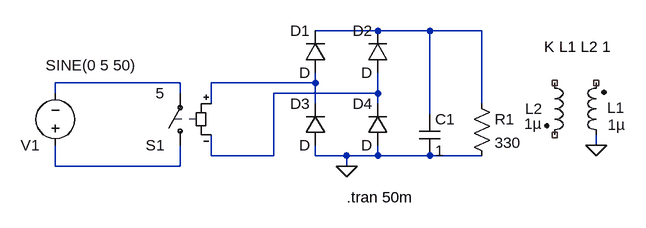
[diagram p0: schematic Joule Thief.asc]
Joule Thief.asc, the LTspice schematic file:
Version 4
SHEET 1 880 680
WIRE 48 16 -48 16
WIRE 128 16 48 16
WIRE 208 16 128 16
WIRE -256 96 -448 96
WIRE -48 96 -48 80
WIRE -48 96 -208 96
WIRE -448 112 -448 96
WIRE -256 112 -256 96
WIRE 48 112 48 80
WIRE 48 112 -112 112
WIRE -208 128 -208 96
WIRE -48 128 -48 96
WIRE 48 128 48 112
WIRE 208 128 208 16
WIRE 128 144 128 16
WIRE 384 192 384 176
WIRE -208 208 -208 176
WIRE -112 208 -112 112
WIRE -112 208 -208 208
WIRE -48 208 -48 192
WIRE 0 208 -48 208
WIRE 48 208 48 192
WIRE 48 208 0 208
WIRE 128 208 48 208
WIRE 208 208 128 208
WIRE -448 224 -448 192
WIRE -256 224 -256 192
WIRE -256 224 -448 224
WIRE 0 224 0 208
FLAG 384 192 0
FLAG 0 224 0
SYMBOL voltage -448 208 R180
WINDOW 3 -125 139 Left 2
WINDOW 123 24 124 Left 2
WINDOW 39 0 0 Left 0
SYMATTR Value SINE(0 5 50)
SYMATTR InstName V1
SYMBOL ind2 304 80 R0
WINDOW 0 97 54 Left 2
WINDOW 3 -31 79 Left 2
SYMATTR InstName L1
SYMATTR Value 1µ
SYMATTR Type ind
SYMBOL ind2 400 192 R180
WINDOW 0 98 56 Left 2
WINDOW 3 -29 32 Left 2
SYMATTR InstName L2
SYMATTR Value 1µ
SYMATTR Type ind
SYMBOL diode -32 80 R180
WINDOW 0 24 64 Left 2
WINDOW 3 24 0 Left 2
SYMATTR InstName D1
SYMBOL diode 64 80 R180
WINDOW 0 24 64 Left 2
WINDOW 3 24 0 Left 2
SYMATTR InstName D2
SYMBOL diode -32 192 R180
WINDOW 0 24 64 Left 2
WINDOW 3 24 0 Left 2
SYMATTR InstName D3
SYMBOL diode 64 192 R180
WINDOW 0 24 64 Left 2
WINDOW 3 24 0 Left 2
SYMATTR InstName D4
SYMBOL cap 112 144 R0
SYMATTR InstName C1
SYMATTR Value 1
SYMBOL res 192 112 R0
SYMATTR InstName R1
SYMATTR Value 330
SYMBOL sw -256 208 R180
SYMATTR InstName S1
SYMATTR Value 5
TEXT 304 40 Left 2 !K L1 L2 1
TEXT 0 272 Left 2 !.tran 50m

The netlist it stands for:
* Joule Thief.asc
V1 N005 N002 SINE(0 5 50)
L1 NC_01 NC_02 1µ
L2 0 NC_03 1µ
D1 N003 N001 D
D2 N004 N001 D
D3 0 N003 D
D4 0 N004 D
C1 N001 0 1
R1 N001 0 330
S1 N005 N002 N003 N004 5
.model D D
.lib standard.dio
K L1 L2 1
.tran 50m
.backanno
.end